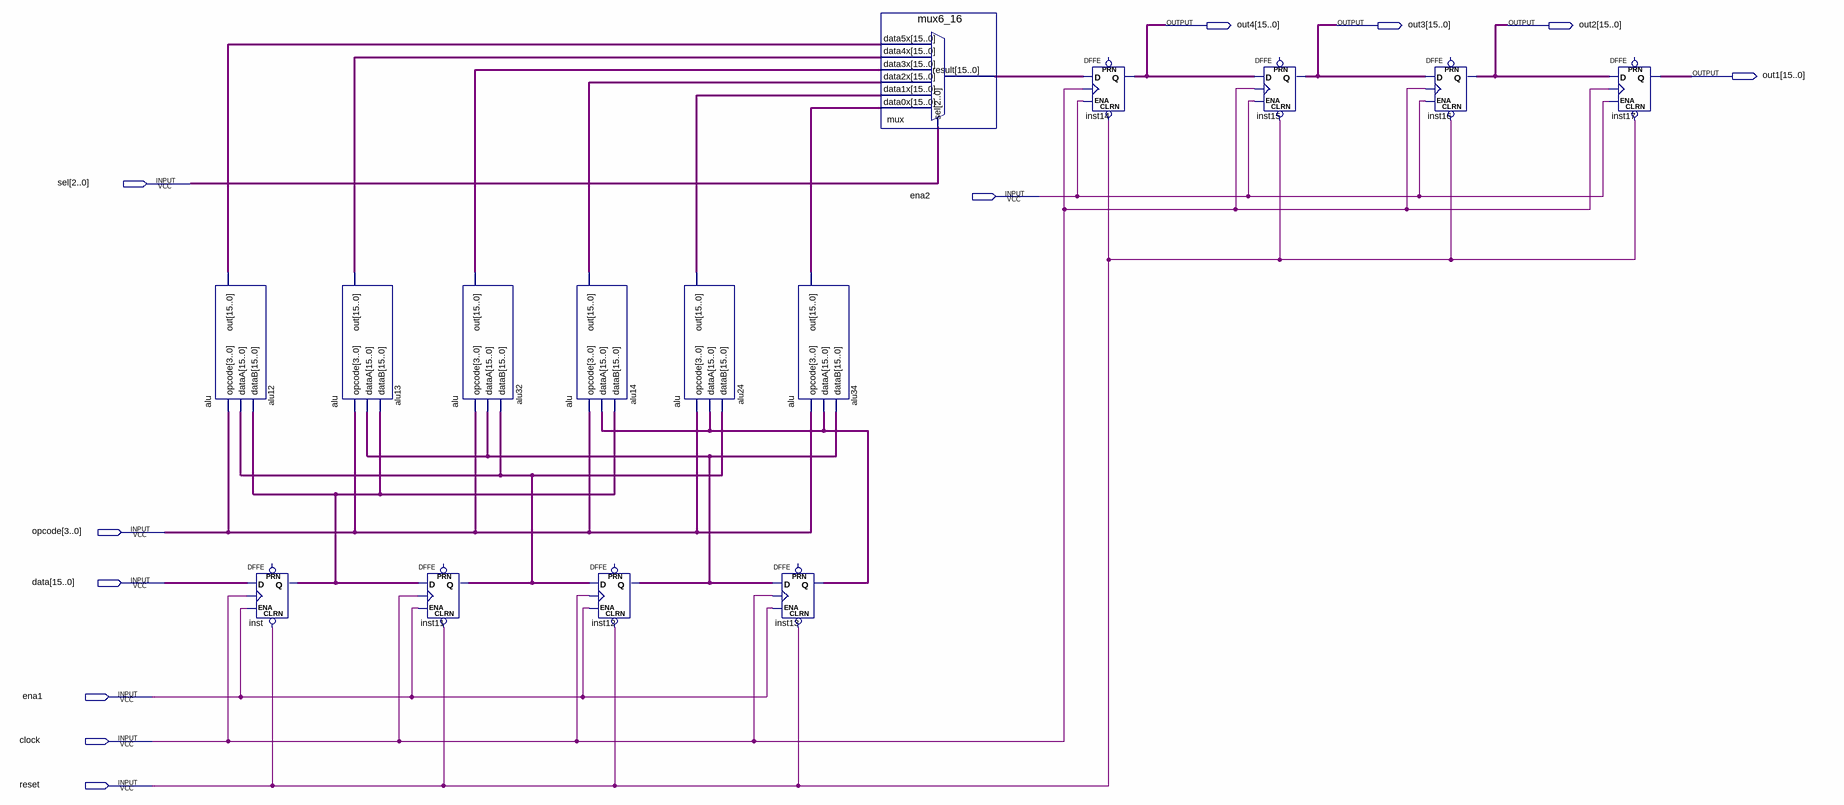
[diagram p0: schematic sheet]
// Quartus schematic junjo.bdf as structural Verilog: 15 symbols, 11 pins
module junjo (
  input  [2:0] sel,
  input  ena2,
  input  [3:0] opcode,
  input  [15:0] data,
  input  ena1,
  input  clock,
  input  reset,
  output [15:0] out4,
  output [15:0] out3,
  output [15:0] out2,
  output [15:0] out1
);

  wire [15:0] alu12_out, alu13_out, alu14_out, alu24_out, alu32_out, alu34_out, inst11_q, inst12_q, inst13_q,
       inst_q, mux_result;

  alu alu12 (.opcode(opcode), .dataA(inst11_q), .dataB(inst_q), .out(alu12_out));
  DFFE inst[15:0] (.CLRN(reset), .D(data), .CLK(clock), .ENA(ena1), .Q(inst_q));  // open: PRN
  alu alu13 (.opcode(opcode), .dataA(inst12_q), .dataB(inst_q), .out(alu13_out));
  alu alu32 (.opcode(opcode), .dataA(inst12_q), .dataB(inst11_q), .out(alu32_out));
  DFFE inst11[15:0] (.CLRN(reset), .D(inst_q), .CLK(clock), .ENA(ena1), .Q(inst11_q));  // open: PRN
  alu alu14 (.opcode(opcode), .dataA(inst13_q), .dataB(inst_q), .out(alu14_out));
  DFFE inst12[15:0] (.CLRN(reset), .D(inst11_q), .CLK(clock), .ENA(ena1), .Q(inst12_q));  // open: PRN
  alu alu24 (.opcode(opcode), .dataA(inst13_q), .dataB(inst11_q), .out(alu24_out));
  alu alu34 (.opcode(opcode), .dataA(inst13_q), .dataB(inst12_q), .out(alu34_out));
  DFFE inst13[15:0] (.CLRN(reset), .D(inst12_q), .CLK(clock), .ENA(ena1), .Q(inst13_q));  // open: PRN
  mux6_16 mux (
    .data5x(alu12_out), .data4x(alu13_out), .data3x(alu32_out), .data2x(alu14_out), .data1x(alu24_out),
    .data0x(alu34_out), .sel(sel), .result(mux_result));
  DFFE inst14[15:0] (.CLRN(reset), .D(mux_result), .CLK(clock), .ENA(ena2), .Q(out4));  // open: PRN
  DFFE inst15[15:0] (.CLRN(reset), .D(out4), .CLK(clock), .ENA(ena2), .Q(out3));  // open: PRN
  DFFE inst16[15:0] (.CLRN(reset), .D(out3), .CLK(clock), .ENA(ena2), .Q(out2));  // open: PRN
  DFFE inst17[15:0] (.CLRN(reset), .D(out2), .CLK(clock), .ENA(ena2), .Q(out1));  // open: PRN
endmodule
